# Altium project 串口MCU板 V2.0.PrjPCB
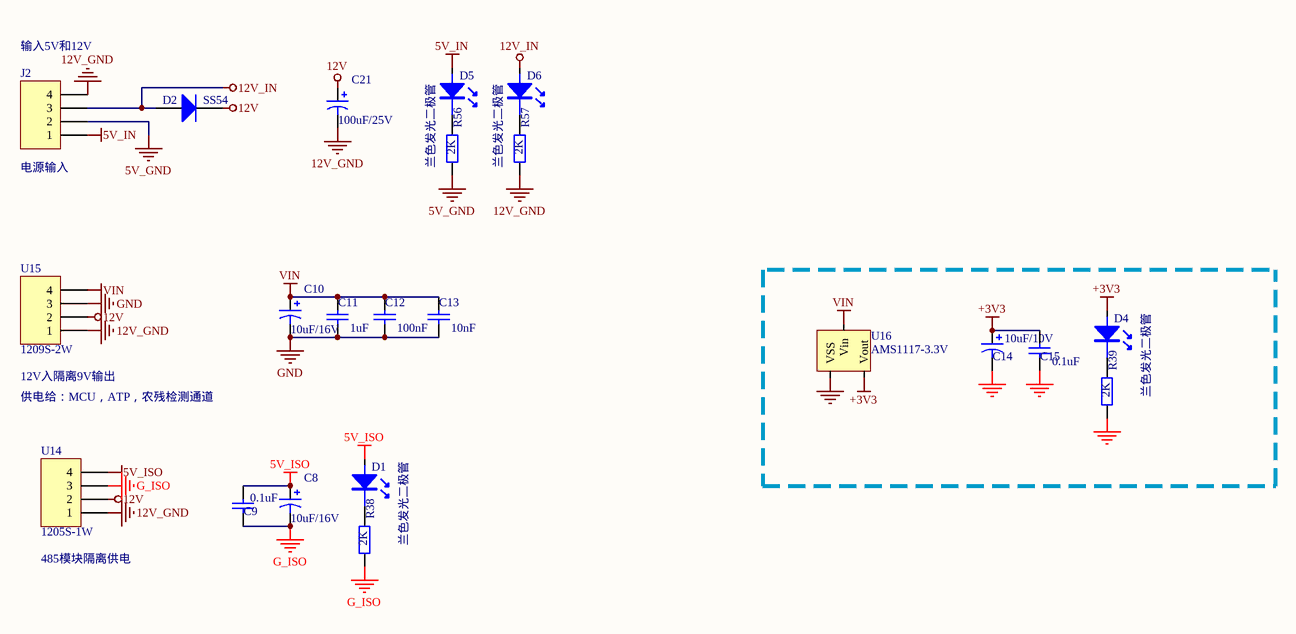
[diagram p0: Power.SchDoc]
3 sheets, 123 parts. Net scope: flat (ports and power ports of the same name join across sheets).
Board file: 串口板2.0.PcbDoc
Sheets:
  Power.SchDoc
  接口.SchDoc
  MOS输出.SchDoc

## Sheet Power.SchDoc
size A4

### Parts
C8  10uF/16V  [3216]
C9  0.1uF  [1608C]
C10  10uF/16V  [3216]
C11  1uF  [1608C]
C12  100nF  [1608C]
C13  10nF  [1608C]
C14  10uF/10V  [3216]
C15  0.1uF  [1608C]
C21  100uF/25V  [ECS6.3/6.6]
D1  兰色发光二极管  [LED/S]
D2  SS54  [SMA_DO-214AC]
D4  兰色发光二极管  [LED/S]
D5  兰色发光二极管  [LED/S]
D6  兰色发光二极管  [LED/S]
J2  电源输入  [KF2EDGV-5.08/4]
R38  2K  [1608]
R39  2K  [1608]
R56  2K  [1608]
R57  2K  [1608]
U14  1205S-1W  [B0505S]
U15  1209S-2W  [B0505S]
U16  AMS1117-3.3V  [SOT223_L]

### Nets
5V_GND: J2.2 R56.2
5V_IN: D5.A J2.1
5V_ISO: C8.1 C9.2 D1.A U14.4
12V: C21.1 D2.2(K) U14.2 U15.2
12V_GND: C21.2 J2.4 R57.2 U14.1 U15.1
12V_IN: D2.1(A) D6.A J2.3
+3V3: C14.1 C15.2 D4.A U16.2(Vout)
G_ISO: C8.2 C9.1 R38.2 U14.3
GND: C10.2 C11.1 C12.1 C13.1 C14.2 C15.1 R39.2 U15.3 U16.1(VSS)
VIN: C10.1 C11.2 C12.2 C13.2 U15.4 U16.3(Vin)
NetD1_K: D1.K R38.1
NetD4_K: D4.K R39.1
NetD5_K: D5.K R56.1
NetD6_K: D6.K R57.1

### Notes on the sheet
- (near J2) 输入5V和12V
- (near U15) 12V入隔离9V输出
- 供电给：MCU，ATP，农残检测通道
- (near U14) 485模块隔离供电

### Library data of the parts
C8 C10 = Cap Pol1: Polarized Capacitor (Radial); Published: 8-Jun-2000; LatestRevisionDate: 17-Jul-2002; LatestRevisionNote: Re-released for DXP Platform.; PackageReference: RB7.6-15; Publisher: Altium Limited; PackageDescription: Polarized Capacitor (Radial); 2 Leads; Value: 10uF/16V
C9 C15 = Cap: Capacitor; Published: 8-Jun-2000; LatestRevisionDate: 17-Jul-2002; LatestRevisionNote: Re-released for DXP Platform.; PackageReference: RAD-0.3; Publisher: Altium Limited; PackageDescription: Radial Cap, Thru-Hole; 2 Leads; 0.3 in Pin Spacing; Value: 0.1uF
C11-C13 = Cap: Capacitor; Value: 0.1uF; Published: 8-Jun-2000; LatestRevisionDate: 17-Jul-2002; LatestRevisionNote: Re-released for DXP Platform.; PackageReference: RAD-0.3; Publisher: Altium Limited; PackageDescription: Radial Cap, Thru-Hole; 2 Leads; 0.3 in Pin Spacing
C14 C21 = Cap Pol1: Polarized Capacitor (Radial); Value: 10uF/16V; Published: 8-Jun-2000; LatestRevisionDate: 17-Jul-2002; LatestRevisionNote: Re-released for DXP Platform.; PackageReference: RB7.6-15; Publisher: Altium Limited
  C21: PackageDescription: Polarized Capacitor (Radial); 2 Leads
D1 D4-D6 = LED
D2 = Diode: Default Diode; Published: 8-Jun-2000; LatestRevisionDate: 17-Jul-2002; LatestRevisionNote: Re-released for DXP Platform.; PackageDocument: Sep-1996; PackageReference: SMC; Publisher: Altium Limited; Code_JEDEC: DO-214-AB
J2 U14 U15 = Header 4: Header, 4-Pin; LatestRevisionDate: 17-Jul-2002; LatestRevisionNote: Re-released for DXP Platform.; Publisher: Altium Limited
R38 R39 R56 R57 = Res2: Resistor; Value: 1K; Published: 8-Jun-2000; LatestRevisionDate: 17-Jul-2002; LatestRevisionNote: Re-released for DXP Platform.; PackageReference: AXIAL-0.4; Publisher: Altium Limited
U16 = Header 3: Header, 3-Pin; LatestRevisionDate: 17-Jul-2002; LatestRevisionNote: Re-released for DXP Platform.; Publisher: Altium Limited

## Sheet 接口.SchDoc
size A4
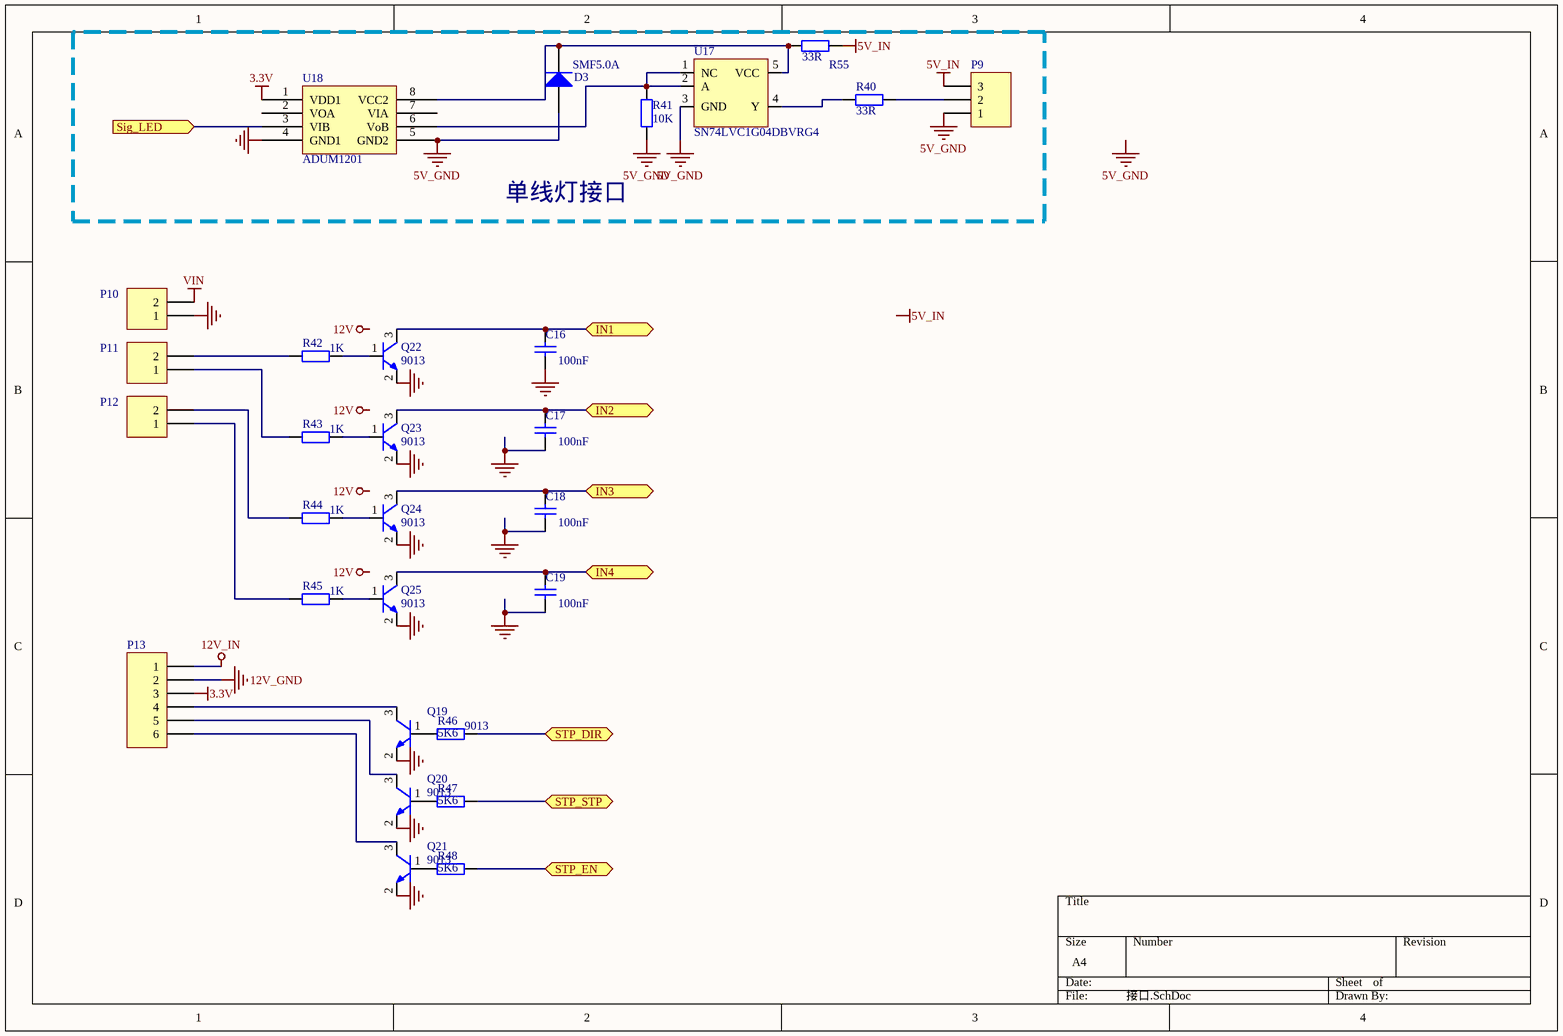
[diagram p1: 接口.SchDoc]

### Parts
C16  100nF  [1608C]
C17  100nF  [1608C]
C18  100nF  [1608C]
C19  100nF  [1608C]
D3  SMF5.0A  [SOD-123]
P9  (no value)  [KF2EDGV-3.81/3]
P10  (no value)  [KF128-3.81-2P]
P11  (no value)  [KF128-3.81-2P]
P12  (no value)  [KF128-3.81-2P]
P13  (no value)  [5264-6]
Q19  9013  [sot-23]
Q20  9013  [sot-23]
Q21  9013  [sot-23]
Q22  9013  [sot-23]
Q23  9013  [sot-23]
Q24  9013  [sot-23]
Q25  9013  [sot-23]
R40  33R  [1608]
R41  10K  [1608]
R42  1K  [1608]
R43  1K  [1608]
R44  1K  [1608]
R45  1K  [1608]
R46  5K6  [1608]
R47  5K6  [1608]
R48  5K6  [1608]
R55  33R  [1608]
U17  SN74LVC1G04DBVRG4  [SOT-23-5]
U18  ADUM1201  [so8]

### Blocks framed on the sheet
单线灯接口: D3 P9 R40 R41 R55 U17 U18

### Ports
IN1, IN2, IN3, IN4, Sig_LED (in), STP_DIR, STP_EN, STP_STP

### Nets
3.3V: P13.3 U18.1(VDD1)
5V_GND: D3.1(A) P9.1 R41.1 U17.3(GND) U18.5(GND2)
5V_IN: P9.3 R55.1
12V_GND: P13.2
12V_IN: P13.1
GND: C16.1 C17.1 C18.1 C19.1 P10.1 Q19.2(E) Q20.2(E) Q21.2(E) Q22.2(E) Q23.2(E) Q24.2(E) Q25.2(E) U18.4(GND1)
VIN: P10.2
NetC16_2: C16.2 Q22.3(C) ; port IN1
NetC17_2: C17.2 Q23.3(C) ; port IN2
NetC18_2: C18.2 Q24.3(C) ; port IN3
NetC19_2: C19.2 Q25.3(C) ; port IN4
NetD3_2: D3.2(K) R55.2 U17.5(VCC) U18.8(VCC2)
NetP9_2: P9.2 R40.1
NetP11_1: P11.1 R43.2
NetP11_2: P11.2 R42.2
NetP12_1: P12.1 R45.2
NetP12_2: P12.2 R44.2
NetP13_4: P13.4 Q19.3(C)
NetP13_5: P13.5 Q20.3(C)
NetP13_6: P13.6 Q21.3(C)
NetQ19_1: Q19.1(B) R46.2
NetQ20_1: Q20.1(B) R47.2
NetQ21_1: Q21.1(B) R48.2
NetQ22_1: Q22.1(B) R42.1
NetQ23_1: Q23.1(B) R43.1
NetQ24_1: Q24.1(B) R44.1
NetQ25_1: Q25.1(B) R45.1
NetR40_2: R40.2 U17.4(Y)
NetR41_2: R41.2 U17.1(NC) U17.2(A) U18.6(VoB)
NetR46_1: R46.1 ; port STP_DIR
NetR47_1: R47.1 ; port STP_STP
NetR48_1: R48.1 ; port STP_EN
NetU18_3: U18.3(VIB) ; port Sig_LED

Not connected (* = marked no-connect by the designer): U18 2(VOA) 7(VIA)

### Notes on the sheet
- Labels drawn without touching a wire or pin: 5V_GND, 5V_IN, 12V

### Library data of the parts
C16-C19 = Cap: Capacitor; Value: 0.1uF; Published: 8-Jun-2000; LatestRevisionDate: 17-Jul-2002; LatestRevisionNote: Re-released for DXP Platform.; PackageReference: RAD-0.3; Publisher: Altium Limited; PackageDescription: Radial Cap, Thru-Hole; 2 Leads; 0.3 in Pin Spacing
D3 = Diode: Default Diode; Published: 8-Jun-2000; LatestRevisionDate: 17-Jul-2002; LatestRevisionNote: Re-released for DXP Platform.; PackageDocument: Sep-1996; PackageReference: SMC; Publisher: Altium Limited; Code_JEDEC: DO-214-AB
P9 = Header 3: Header, 3-Pin; LatestRevisionDate: 17-Jul-2002; LatestRevisionNote: Re-released for DXP Platform.; Publisher: Altium Limited
P10-P12 = Header 2: Header, 2-Pin; LatestRevisionDate: 17-Jul-2002; LatestRevisionNote: Re-released for DXP Platform.; Publisher: Altium Limited
P13 = Header 6: Header, 6-Pin; LatestRevisionDate: 17-Jul-2002; LatestRevisionNote: Re-released for DXP Platform.; Publisher: Altium Limited
Q19-Q25 = NPNBT
R40 R41 R55 = Res2: Resistor; Value: 1K; Published: 8-Jun-2000; LatestRevisionDate: 17-Jul-2002; LatestRevisionNote: Re-released for DXP Platform.; PackageReference: 2012; Publisher: Altium Limited
R42-R45 = Res2: Resistor; Published: 8-Jun-2000; LatestRevisionDate: 17-Jul-2002; LatestRevisionNote: Re-released for DXP Platform.; PackageReference: 2012; Publisher: Altium Limited; Value: 1K
R46-R48 = Res2: Resistor; Value: 220R; Published: 8-Jun-2000; LatestRevisionDate: 17-Jul-2002; LatestRevisionNote: Re-released for DXP Platform.; PackageReference: AXIAL-0.4; Publisher: Altium Limited
U17 = LMV321
U18 = max485

## Sheet MOS输出.SchDoc
size A4
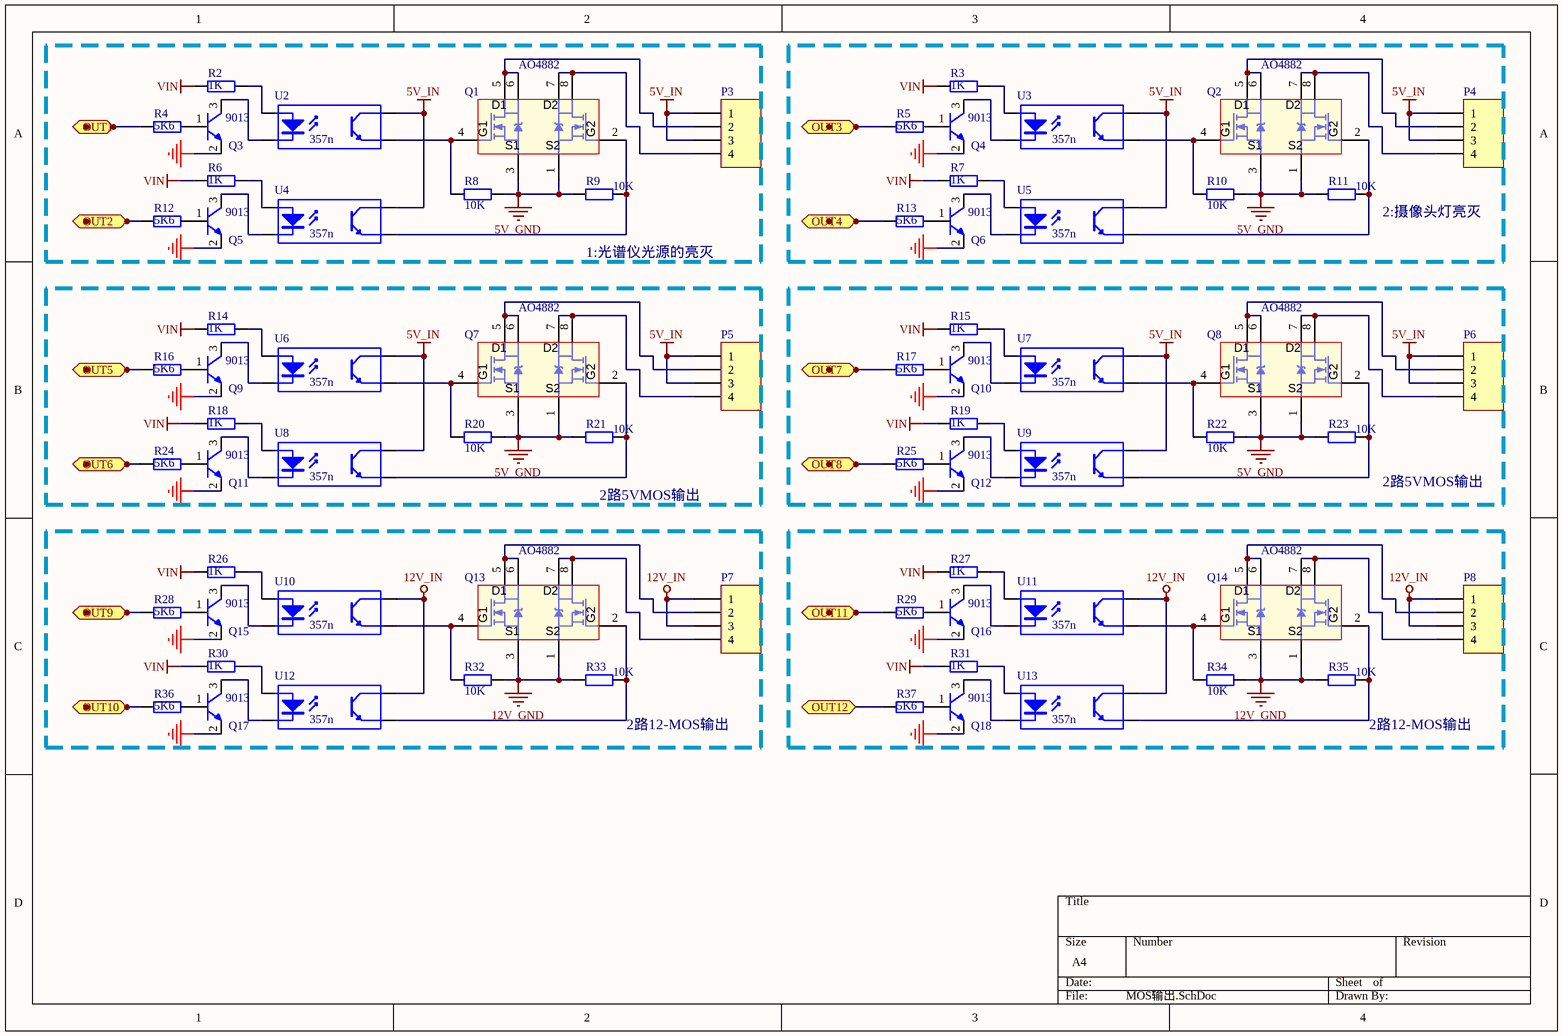
[diagram p2: MOS输出.SchDoc]

### Parts
P3  (no value)  [CAN3.81W/4]
P4  (no value)  [CAN3.81W/4]
P5  (no value)  [CAN3.81W/4]
P6  (no value)  [CAN3.81W/4]
P7  (no value)  [CAN3.81W/4]
P8  (no value)  [CAN3.81W/4]
Q1  AO4882  [so8]
Q2  AO4882  [so8]
Q3  9013  [sot-23]
Q4  9013  [sot-23]
Q5  9013  [sot-23]
Q6  9013  [sot-23]
Q7  AO4882  [so8]
Q8  AO4882  [so8]
Q9  9013  [sot-23]
Q10  9013  [sot-23]
Q11  9013  [sot-23]
Q12  9013  [sot-23]
Q13  AO4882  [so8]
Q14  AO4882  [so8]
Q15  9013  [sot-23]
Q16  9013  [sot-23]
Q17  9013  [sot-23]
Q18  9013  [sot-23]
R2  1K  [1608]
R3  1K  [1608]
R4  5K6  [1608]
R5  5K6  [1608]
R6  1K  [1608]
R7  1K  [1608]
R8  10K  [1608]
R9  10K  [1608]
R10  10K  [1608]
R11  10K  [1608]
R12  5K6  [1608]
R13  5K6  [1608]
R14  1K  [1608]
R15  1K  [1608]
R16  5K6  [1608]
R17  5K6  [1608]
R18  1K  [1608]
R19  1K  [1608]
R20  10K  [1608]
R21  10K  [1608]
R22  10K  [1608]
R23  10K  [1608]
R24  5K6  [1608]
R25  5K6  [1608]
R26  1K  [1608]
R27  1K  [1608]
R28  5K6  [1608]
R29  5K6  [1608]
R30  1K  [1608]
R31  1K  [1608]
R32  10K  [1608]
R33  10K  [1608]
R34  10K  [1608]
R35  10K  [1608]
R36  5K6  [1608]
R37  5K6  [1608]
U2  357n  [375N]
U3  357n  [375N]
U4  357n  [375N]
U5  357n  [375N]
U6  357n  [375N]
U7  357n  [375N]
U8  357n  [375N]
U9  357n  [375N]
U10  357n  [375N]
U11  357n  [375N]
U12  357n  [375N]
U13  357n  [375N]

### Blocks framed on the sheet
1:光谱仪光源的亮灭: P3 Q1 Q3 Q5 R2 R4 R6 R8 R9 R12 U2 U4
2:摄像头灯亮灭: P4 Q2 Q4 Q6 R3 R5 R7 R10 R11 R13 U3 U5
2路5VMOS输出: P5 Q7 Q9 Q11 R14 R16 R18 R20 R21 R24 U6 U8
2路5VMOS输出: P6 Q8 Q10 Q12 R15 R17 R19 R22 R23 R25 U7 U9
2路12-MOS输出: P7 Q13 Q15 Q17 R26 R28 R30 R32 R33 R36 U10 U12
2路12-MOS输出: P8 Q14 Q16 Q18 R27 R29 R31 R34 R35 R37 U11 U13

### Ports
OUT1, OUT2, OUT3, OUT4, OUT5, OUT6, OUT7, OUT8, OUT9, OUT10, OUT11, OUT12

### Nets
5V_GND: Q1.1(S2) Q1.3(S1) Q2.1(S2) Q2.3(S1) Q7.1(S2) Q7.3(S1) Q8.1(S2) Q8.3(S1) R8.1 R9.2 R10.1 R11.2 R20.1 R21.2 R22.1 R23.2
5V_IN: P3.1 P3.3 P4.1 P4.3 P5.1 P5.3 P6.1 P6.3 U2.4(C) U3.4(C) U4.4(C) U5.4(C) U6.4(C) U7.4(C) U8.4(C) U9.4(C)
12V_GND: Q13.1(S2) Q13.3(S1) Q14.1(S2) Q14.3(S1) R32.1 R33.2 R34.1 R35.2
12V_IN: P7.1 P7.3 P8.1 P8.3 U10.4(C) U11.4(C) U12.4(C) U13.4(C)
GND: Q3.2(E) Q4.2(E) Q5.2(E) Q6.2(E) Q9.2(E) Q10.2(E) Q11.2(E) Q12.2(E) Q15.2(E) Q16.2(E) Q17.2(E) Q18.2(E)
VIN: R2.2 R3.2 R6.2 R7.2 R14.2 R15.2 R18.2 R19.2 R26.2 R27.2 R30.2 R31.2
NetP3_2: P3.2 Q1.5(D1) Q1.6(D1)
NetP3_4: P3.4 Q1.7(D2) Q1.8(D2)
NetP4_2: P4.2 Q2.5(D1) Q2.6(D1)
NetP4_4: P4.4 Q2.7(D2) Q2.8(D2)
NetP5_2: P5.2 Q7.5(D1) Q7.6(D1)
NetP5_4: P5.4 Q7.7(D2) Q7.8(D2)
NetP6_2: P6.2 Q8.5(D1) Q8.6(D1)
NetP6_4: P6.4 Q8.7(D2) Q8.8(D2)
NetP7_2: P7.2 Q13.5(D1) Q13.6(D1)
NetP7_4: P7.4 Q13.7(D2) Q13.8(D2)
NetP8_2: P8.2 Q14.5(D1) Q14.6(D1)
NetP8_4: P8.4 Q14.7(D2) Q14.8(D2)
NetQ1_2: Q1.2(G2) R9.1 U4.3(E)
NetQ1_4: Q1.4(G1) R8.2 U2.3(E)
NetQ2_2: Q2.2(G2) R11.1 U5.3(E)
NetQ2_4: Q2.4(G1) R10.2 U3.3(E)
NetQ3_1: Q3.1(B) R4.1
NetQ3_3: Q3.3(C) U2.2(K)
NetQ4_1: Q4.1(B) R5.1
NetQ4_3: Q4.3(C) U3.2(K)
NetQ5_1: Q5.1(B) R12.1
NetQ5_3: Q5.3(C) U4.2(K)
NetQ6_1: Q6.1(B) R13.1
NetQ6_3: Q6.3(C) U5.2(K)
NetQ7_2: Q7.2(G2) R21.1 U8.3(E)
NetQ7_4: Q7.4(G1) R20.2 U6.3(E)
NetQ8_2: Q8.2(G2) R23.1 U9.3(E)
NetQ8_4: Q8.4(G1) R22.2 U7.3(E)
NetQ9_1: Q9.1(B) R16.1
NetQ9_3: Q9.3(C) U6.2(K)
NetQ10_1: Q10.1(B) R17.1
NetQ10_3: Q10.3(C) U7.2(K)
NetQ11_1: Q11.1(B) R24.1
NetQ11_3: Q11.3(C) U8.2(K)
NetQ12_1: Q12.1(B) R25.1
NetQ12_3: Q12.3(C) U9.2(K)
NetQ13_2: Q13.2(G2) R33.1 U12.3(E)
NetQ13_4: Q13.4(G1) R32.2 U10.3(E)
NetQ14_2: Q14.2(G2) R35.1 U13.3(E)
NetQ14_4: Q14.4(G1) R34.2 U11.3(E)
NetQ15_1: Q15.1(B) R28.1
NetQ15_3: Q15.3(C) U10.2(K)
NetQ16_1: Q16.1(B) R29.1
NetQ16_3: Q16.3(C) U11.2(K)
NetQ17_1: Q17.1(B) R36.1
NetQ17_3: Q17.3(C) U12.2(K)
NetQ18_1: Q18.1(B) R37.1
NetQ18_3: Q18.3(C) U13.2(K)
NetR2_1: R2.1 U2.1(A)
NetR3_1: R3.1 U3.1(A)
NetR4_2: R4.2 ; port OUT1
NetR5_2: R5.2 ; port OUT3
NetR6_1: R6.1 U4.1(A)
NetR7_1: R7.1 U5.1(A)
NetR12_2: R12.2 ; port OUT2
NetR13_2: R13.2 ; port OUT4
NetR14_1: R14.1 U6.1(A)
NetR15_1: R15.1 U7.1(A)
NetR16_2: R16.2 ; port OUT5
NetR17_2: R17.2 ; port OUT7
NetR18_1: R18.1 U8.1(A)
NetR19_1: R19.1 U9.1(A)
NetR24_2: R24.2 ; port OUT6
NetR25_2: R25.2 ; port OUT8
NetR26_1: R26.1 U10.1(A)
NetR27_1: R27.1 U11.1(A)
NetR28_2: R28.2 ; port OUT9
NetR29_2: R29.2 ; port OUT11
NetR30_1: R30.1 U12.1(A)
NetR31_1: R31.1 U13.1(A)
NetR36_2: R36.2 ; port OUT10
NetR37_2: R37.2 ; port OUT12

### Library data of the parts
P3-P8 = Header 4: Header, 4-Pin; LatestRevisionDate: 17-Jul-2002; LatestRevisionNote: Re-released for DXP Platform.; Publisher: Altium Limited
Q1 Q2 Q7 Q8 Q13 Q14 = AO4882 MOSFET 2N-CH 40V 8A 8SOIC: Mosfet Array 2 N-Channel (Dual) 40V 8A 2W Surface Mount 8-SOIC; MF: Alpha & Omega Semiconductor Inc.; MPN: AO4882
Q3-Q6 Q9-Q12 Q15-Q18 = NPNBT
R2-R7 R12-R19 R24-R31 R36 R37 = Res2: Resistor; Value: 220R; Published: 8-Jun-2000; LatestRevisionDate: 17-Jul-2002; LatestRevisionNote: Re-released for DXP Platform.; PackageReference: AXIAL-0.4; Publisher: Altium Limited
R8-R11 R20-R23 R32-R35 = Res2: Resistor; Published: 8-Jun-2000; LatestRevisionDate: 17-Jul-2002; LatestRevisionNote: Re-released for DXP Platform.; PackageReference: AXIAL-0.4; Publisher: Altium Limited; Value: 10K
U2-U13 = Optoisolator1: 4-Pin Phototransistor Optocoupler; Published: 24-Mar-1999; LatestRevisionDate: 04-Mar-2005; LatestRevisionNote: Sch pins 3 & 4 Swapped.; DatasheetDocument: Nov-2003; PackageReference: DIP-4; Publisher: Altium Limited

## Nets that join several sheets
5V_GND: Power (J2.2 R56.2), 接口 (5 pins), MOS输出 (16 pins)
5V_IN: Power (D5.A J2.1), 接口 (P9.3 R55.1), MOS输出 (16 pins)
12V_GND: Power (5 pins), 接口 (P13.2), MOS输出 (8 pins)
12V_IN: Power (D2.1 D6.A J2.3), 接口 (P13.1), MOS输出 (8 pins)
GND: Power (9 pins), 接口 (13 pins), MOS输出 (12 pins)
VIN: Power (6 pins), 接口 (P10.2), MOS输出 (12 pins)